# EAGLE design QFN16 (EAGLE 9.2.2)
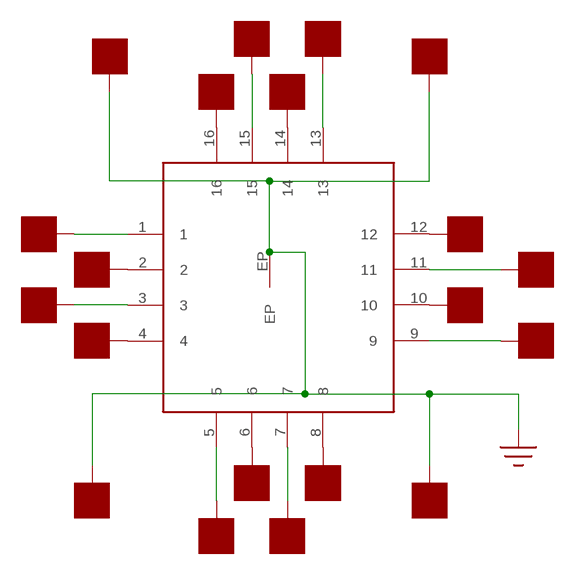
[diagram p0: schematic, sheet 1]

## Parts
U$1  QFN16  [TQFN16-EP]
U$2  PAD50MIL  [PAD_50MIL]
U$3  PAD50MIL  [PAD_50MIL]
U$4  PAD50MIL  [PAD_50MIL]
U$5  PAD50MIL  [PAD_50MIL]
U$6  PAD50MIL  [PAD_50MIL]
U$7  PAD50MIL  [PAD_50MIL]
U$8  PAD50MIL  [PAD_50MIL]
U$9  PAD50MIL  [PAD_50MIL]
U$10  PAD50MIL  [PAD_50MIL]
U$11  PAD50MIL  [PAD_50MIL]
U$12  PAD50MIL  [PAD_50MIL]
U$13  PAD50MIL  [PAD_50MIL]
U$14  PAD50MIL  [PAD_50MIL]
U$15  PAD50MIL  [PAD_50MIL]
U$16  PAD50MIL  [PAD_50MIL]
U$17  PAD50MIL  [PAD_50MIL]
U$18  PAD50MIL  [PAD_50MIL]
U$19  PAD50MIL  [PAD_50MIL]
U$20  PAD50MIL  [PAD_50MIL]
U$21  PAD50MIL  [PAD_50MIL]

## Nets
GND: U$1.EP U$18.P$1 U$19.P$1 U$20.P$1 U$21.P$1
N$1: U$1.12 U$2.P$1
N$2: U$1.10 U$4.P$1
N$3: U$1.8 U$6.P$1
N$4: U$1.6 U$8.P$1
N$5: U$1.4 U$10.P$1
N$6: U$1.2 U$12.P$1
N$7: U$1.16 U$14.P$1
N$8: U$1.14 U$16.P$1
N$9: U$1.15 U$15.P$1
N$10: U$1.13 U$17.P$1
N$11: U$1.11 U$3.P$1
N$12: U$1.9 U$5.P$1
N$13: U$1.7 U$7.P$1
N$14: U$1.5 U$9.P$1
N$15: U$1.3 U$11.P$1
N$16: U$1.1 U$13.P$1

## Library data of the parts
U$1 = yapo:QFN16
U$2-U$21 = yapo:PAD

## Board
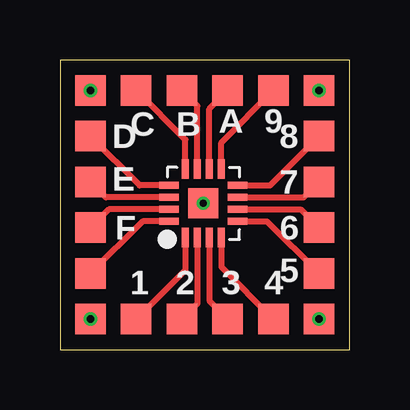
[diagram p1: board, top side]
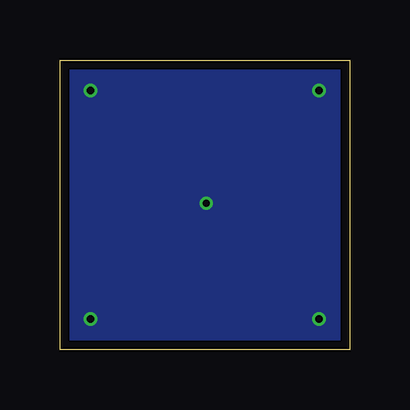
[diagram p2: board, bottom side, seen from below]

Size 12.06 x 12.06 mm. Coordinates in mm from the lower left corner, seen from the top.
Outline: 0,0 12.06,0 12.06,12.06 0,12.06 0,0
Copper layers (1*16): Top 0.035559375mm / dielectric 1.6mm / Bottom 0.035559375mm
Design rules "oshpark-2layer": minimum track width 6mil, minimum drill 10mil, track to track 6mil, track to pad 6mil, pad to pad 6mil, via to via 6mil, smd to smd 6mil, copper to edge 15mil, drill to drill 6mil, minimum pad ring 5mil, minimum via ring 5mil, stop-mask expansion 2.5mil, vias tented up to drill 0mil, thermal gap 10mil

### Footprints (pad centres in the part's own frame; a part is rotated, then mirrored left to right if it is on the bottom)
TQFN16-EP = smd 0.3 x 0.8: 1 -0.75,-1.425; 2 -0.25,-1.425; 3 0.25,-1.425; 4 0.75,-1.425; 9 0.75,1.425; 10 0.25,1.425; 11 -0.25,1.425; 12 -0.75,1.425 | smd 0.8 x 0.3: 5 1.425,-0.75; 6 1.425,-0.25; 7 1.425,0.25; 8 1.425,0.75; 13 -1.425,0.75; 14 -1.425,0.25; 15 -1.425,-0.25; 16 -1.425,-0.75 | smd 1.23 x 1.23: EP 0,0
PAD_50MIL = smd 1.27 x 1.27: P$1 0,0

### Placement (x,y rotation side)
U$1  5.97,6.1 0 top
U$2  3.17,10.79 0 top
U$3  5.08,10.79 0 top
U$4  6.99,10.79 0 top
U$5  8.89,10.79 0 top
U$6  10.79,8.89 0 top
U$7  10.79,6.99 0 top
U$8  10.79,5.08 0 top
U$9  10.79,3.17 0 top
U$10  8.89,1.27 0 top
U$11  6.99,1.27 0 top
U$12  5.08,1.27 0 top
U$13  3.17,1.27 0 top
U$14  1.27,3.17 0 top
U$15  1.27,5.08 0 top
U$16  1.27,6.99 0 top
U$17  1.27,8.89 0 top
U$18  1.27,1.27 0 top
U$19  10.79,1.27 0 top
U$20  1.27,10.79 0 top
U$21  10.79,10.79 0 top

### Tracks (layer width: path | path; a pad name or v marks a point on that pad's centre or on a via)
GND  (via drill 0.3)
  other vias: 5.97,6.1 1.27,10.79 10.79,10.79 10.79,1.27 1.27,1.27
  pour Bottom: 0,0 12.06,0 12.06,12.06 0,12.06
N$1
  Top 0.254: U$1.12 5.22,8.75 U$2.P$1
N$2
  Top 0.254: U$1.10 6.22,10.03 U$4.P$1
N$3
  Top 0.254: U$1.8 8.75,6.85 U$6.P$1
N$4
  Top 0.254: U$1.6 10.03,5.85 U$8.P$1
N$5
  Top 0.254: U$1.4 6.72,3.44 U$10.P$1
N$6
  Top 0.254: U$1.2 5.72,1.91 U$12.P$1
N$7
  Top 0.254: U$1.16 3.44,5.35 U$14.P$1
N$8
  Top 0.254: U$1.14 1.91,6.35 U$16.P$1
N$9
  Top 0.254: U$1.15 2.04,5.85 U$15.P$1
N$10
  Top 0.254: U$1.13 3.31,6.85 U$17.P$1
N$11
  Top 0.254: U$1.11 5.72,10.16 U$3.P$1
N$12
  Top 0.254: U$1.9 6.72,8.62 U$5.P$1
N$13
  Top 0.254: U$1.7 10.16,6.35 U$7.P$1
N$14
  Top 0.254: U$1.5 8.62,5.35 U$9.P$1
N$15
  Top 0.254: U$1.3 6.22,2.04 U$11.P$1
N$16
  Top 0.254: U$1.1 5.22,3.31 U$13.P$1

### Text on the board
tPlace: C | B | A | 9 | D | 8 | E | 7 | F | 6 | 5 | 1 | 2 | 3 | 4